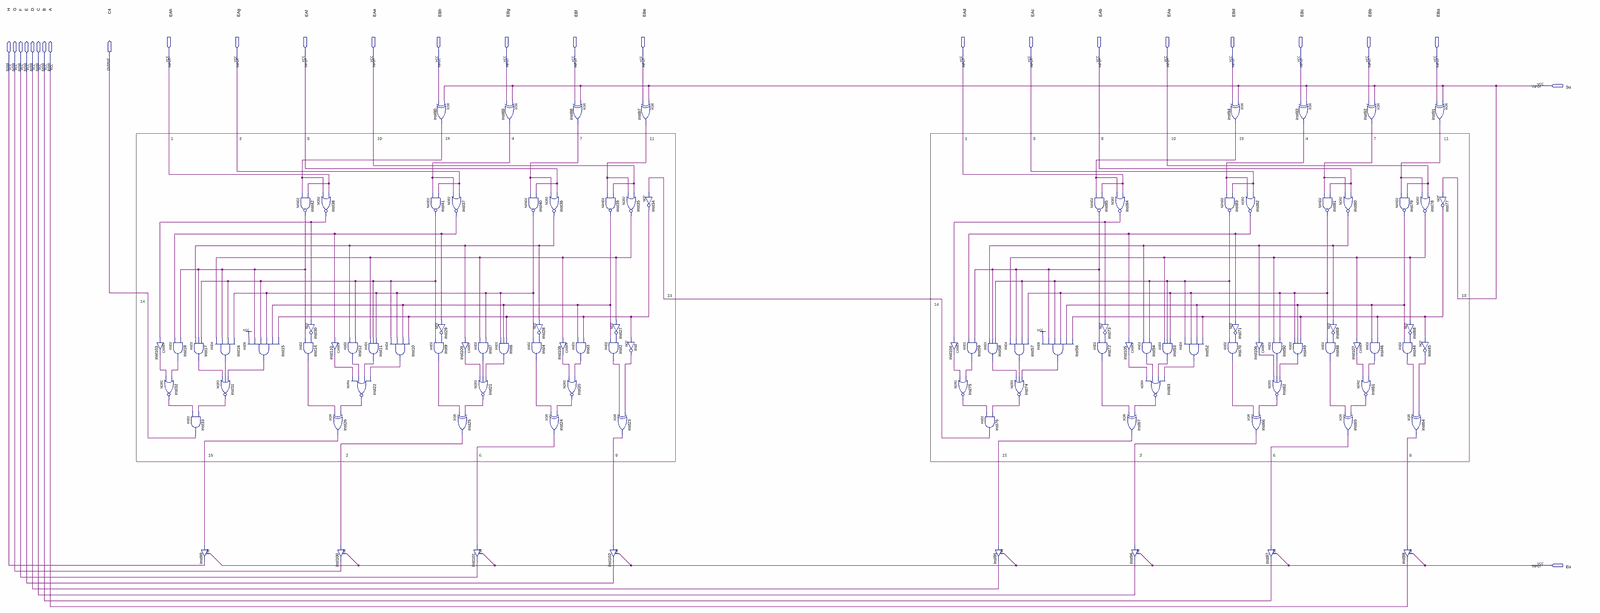
[diagram p0: schematic sheet, whole]
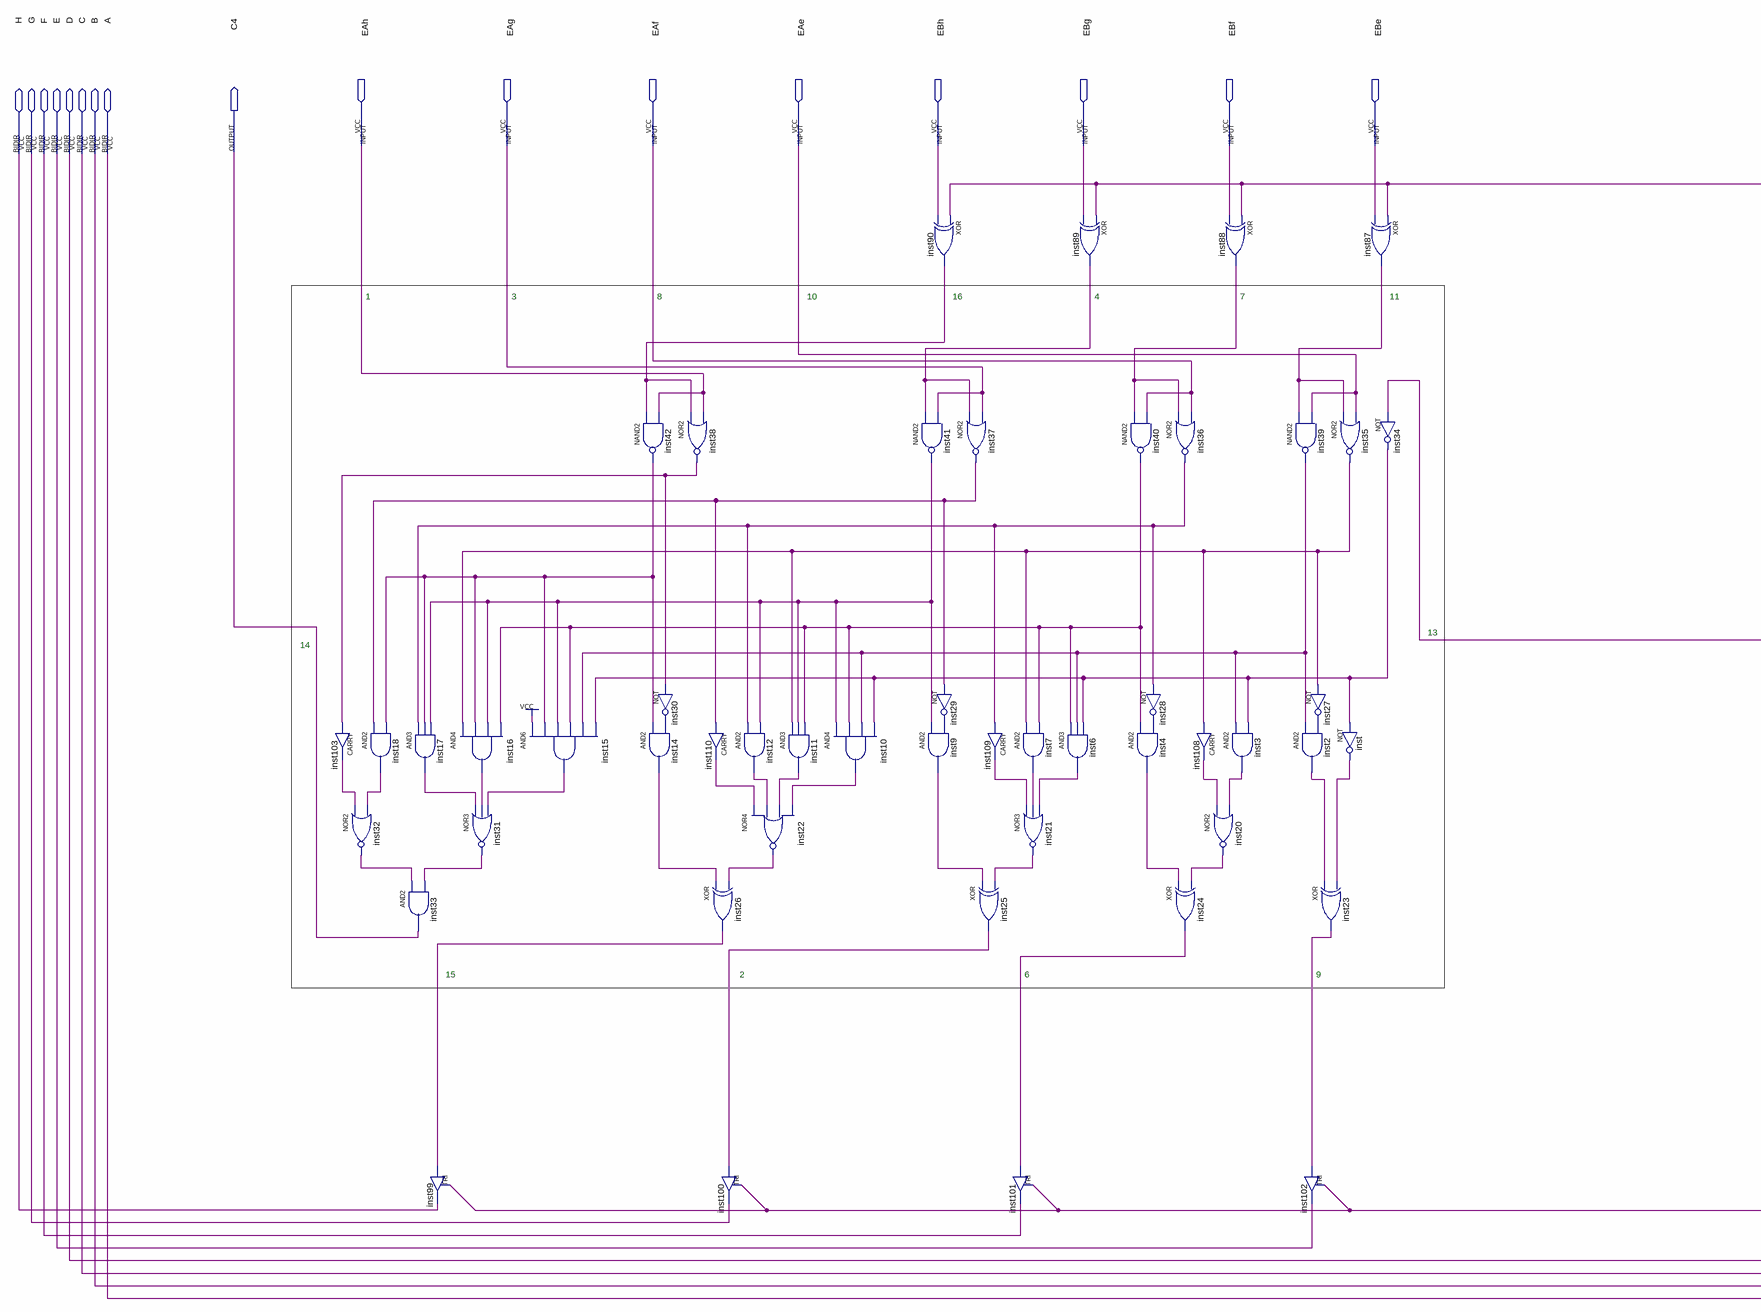
[diagram p1: schematic sheet, left part]
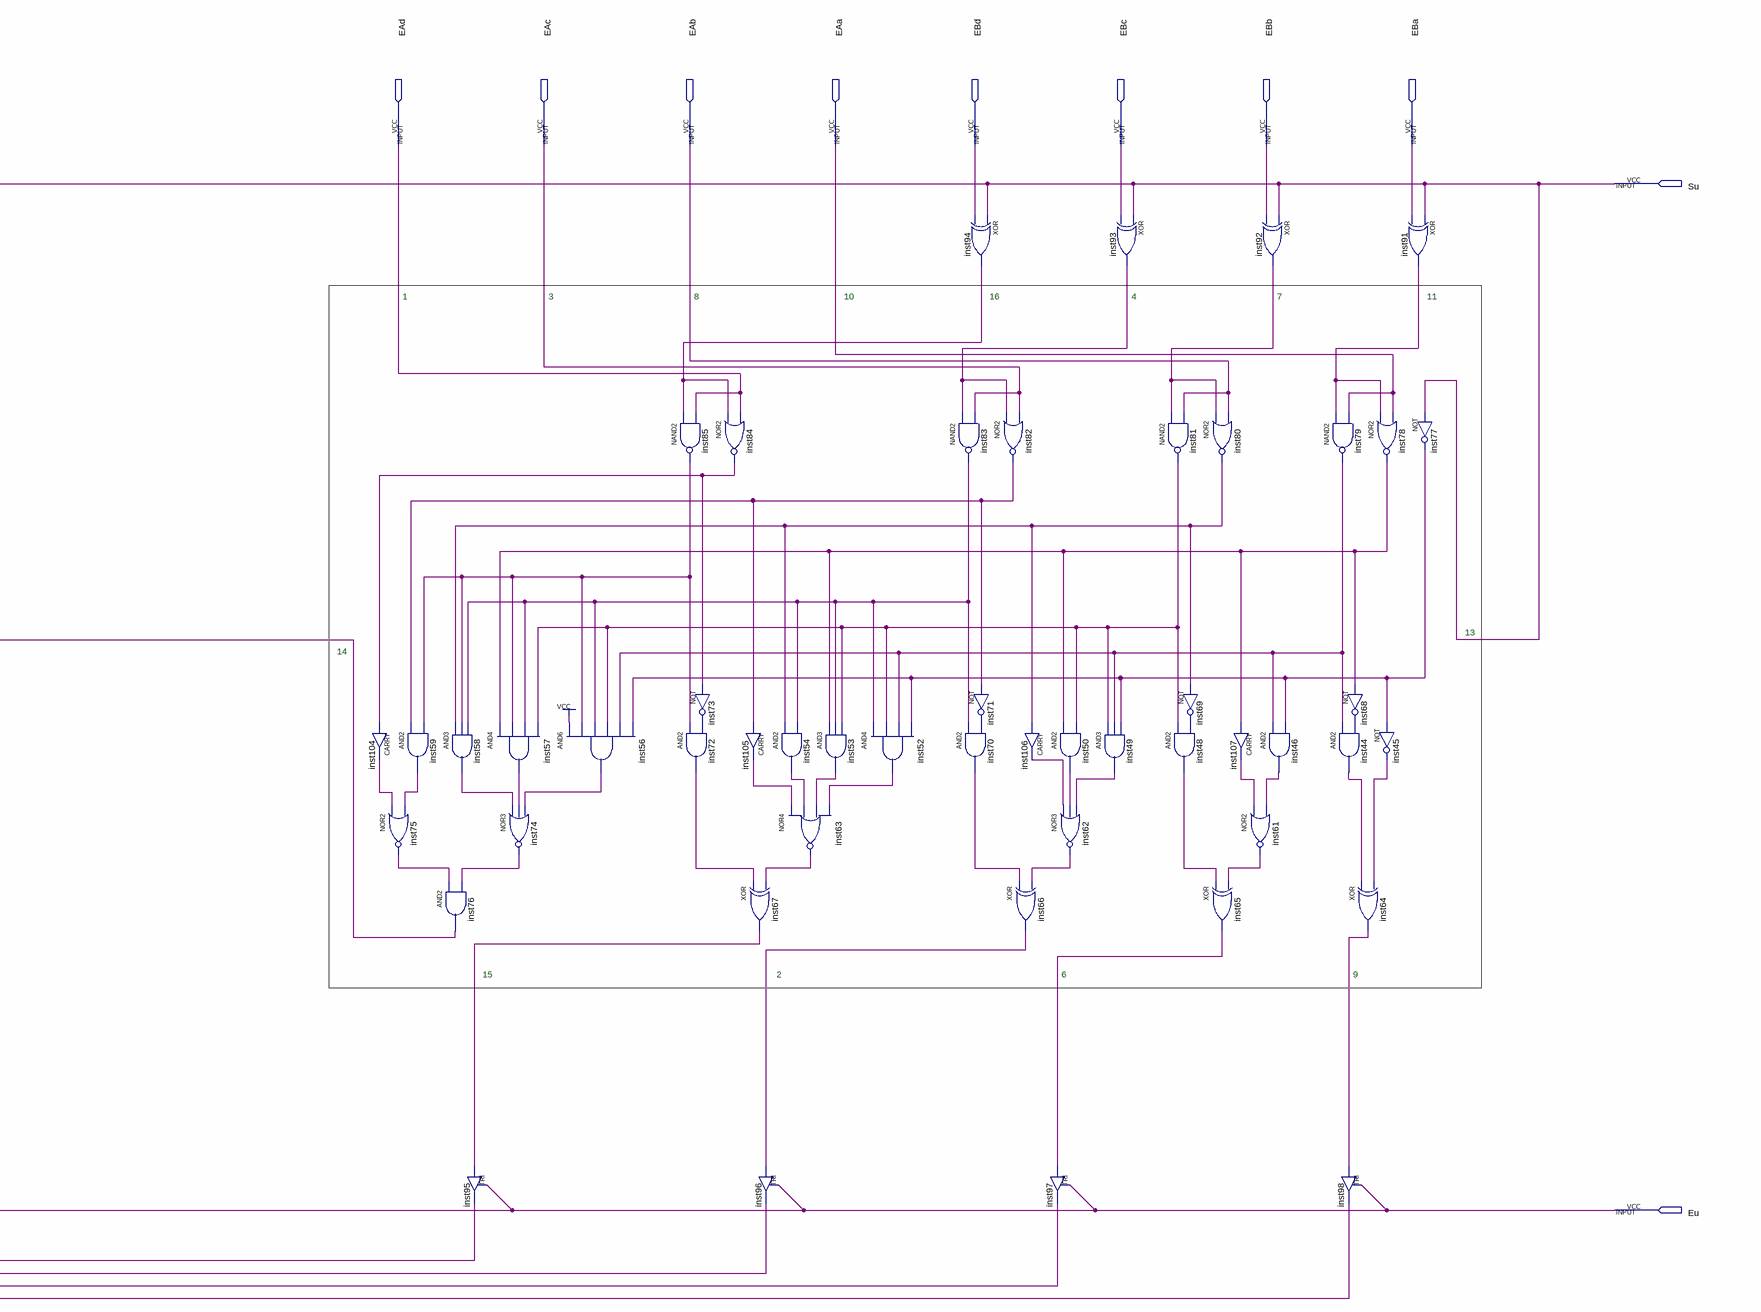
[diagram p2: schematic sheet, right part]
// Quartus schematic adder_and_subtractor.bdf as structural Verilog: 100 symbols, 27 pins
module adder_and_subtractor (
  input  EAh,
  input  EAg,
  input  EAf,
  input  EAe,
  input  EBh,
  input  EBg,
  input  EBf,
  input  EBe,
  input  EAd,
  input  EAc,
  input  EAb,
  input  EAa,
  input  EBd,
  input  EBc,
  input  EBb,
  input  EBa,
  input  Su,
  input  Eu,
  inout  H,
  inout  G,
  inout  F,
  inout  E,
  inout  D,
  inout  C,
  inout  B,
  inout  A,
  output C4
);

  wire inst2_out, inst3_out, inst4_out, inst6_out, inst7_out, inst9_out, inst10_out, inst11_out, inst12_out,
       inst14_out, inst15_out, inst16_out, inst17_out, inst18_out, inst20_out, inst21_out, inst22_out,
       inst23_out, inst24_out, inst25_out, inst26_out, inst27_out, inst28_out, inst29_out, inst30_out,
       inst31_out, inst32_out, inst34_out, inst35_out, inst36_out, inst37_out, inst38_out, inst39_out,
       inst40_out, inst41_out, inst42_out, inst44_out, inst45_out, inst46_out, inst48_out, inst49_out,
       inst50_out, inst52_out, inst53_out, inst54_out, inst56_out, inst57_out, inst58_out, inst59_out,
       inst61_out, inst62_out, inst63_out, inst64_out, inst65_out, inst66_out, inst67_out, inst68_out,
       inst69_out, inst70_out, inst71_out, inst72_out, inst73_out, inst74_out, inst75_out, inst76_out,
       inst77_out, inst78_out, inst79_out, inst80_out, inst81_out, inst82_out, inst83_out, inst84_out,
       inst85_out, inst87_out, inst88_out, inst89_out, inst90_out, inst91_out, inst92_out, inst93_out,
       inst94_out, inst103_out, inst104_out, inst105_out, inst106_out, inst107_out, inst108_out, inst109_out,
       inst110_out, inst_out;

  and inst18 (inst18_out, inst37_out, inst42_out);
  CARRY inst103 (.IN(inst38_out), .OUT(inst103_out));
  nor inst32 (inst32_out, inst103_out, inst18_out);
  and inst17 (inst17_out, inst36_out, inst42_out, inst41_out);
  and inst33 (C4, inst32_out, inst31_out);
  and inst16 (inst16_out, inst35_out, inst42_out, inst41_out, inst40_out);
  nor inst31 (inst31_out, inst17_out, inst16_out, inst15_out);
  TRI inst99 (.IN(inst26_out), .OE(Eu), .OUT(H));
  and inst15 (inst15_out, 1'b1, inst42_out, inst41_out, inst40_out, inst39_out, inst34_out);
  nand inst42 (inst42_out, inst90_out, EAh);
  not inst30 (inst30_out, inst38_out);
  and inst14 (inst14_out, inst42_out, inst30_out);
  nor inst38 (inst38_out, inst90_out, EAh);
  CARRY inst110 (.IN(inst37_out), .OUT(inst110_out));
  xor inst26 (inst26_out, inst14_out, inst22_out);
  TRI inst100 (.IN(inst25_out), .OE(Eu), .OUT(G));
  and inst12 (inst12_out, inst36_out, inst41_out);
  nor inst22 (inst22_out, inst110_out, inst12_out, inst11_out, inst10_out);
  and inst10 (inst10_out, inst41_out, inst40_out, inst39_out, inst34_out);
  and inst11 (inst11_out, inst35_out, inst41_out, inst40_out);
  xor inst90 (inst90_out, Su, EBh);
  nand inst41 (inst41_out, inst89_out, EAg);
  and inst9 (inst9_out, inst41_out, inst29_out);
  nor inst37 (inst37_out, inst89_out, EAg);
  not inst29 (inst29_out, inst37_out);
  xor inst25 (inst25_out, inst9_out, inst21_out);
  and inst7 (inst7_out, inst35_out, inst40_out);
  CARRY inst109 (.IN(inst36_out), .OUT(inst109_out));
  nor inst21 (inst21_out, inst109_out, inst7_out, inst6_out);
  TRI inst101 (.IN(inst24_out), .OE(Eu), .OUT(F));
  xor inst89 (inst89_out, Su, EBg);
  and inst6 (inst6_out, inst40_out, inst39_out, inst34_out);
  nand inst40 (inst40_out, inst88_out, EAf);
  and inst4 (inst4_out, inst40_out, inst28_out);
  nor inst36 (inst36_out, inst88_out, EAf);
  not inst28 (inst28_out, inst36_out);
  xor inst24 (inst24_out, inst4_out, inst20_out);
  xor inst88 (inst88_out, Su, EBf);
  and inst3 (inst3_out, inst39_out, inst34_out);
  CARRY inst108 (.IN(inst35_out), .OUT(inst108_out));
  nor inst20 (inst20_out, inst108_out, inst3_out);
  nor inst35 (inst35_out, inst87_out, EAe);
  nand inst39 (inst39_out, inst87_out, EAe);
  not inst27 (inst27_out, inst35_out);
  and inst2 (inst2_out, inst39_out, inst27_out);
  xor inst23 (inst23_out, inst2_out, inst_out);
  TRI inst102 (.IN(inst23_out), .OE(Eu), .OUT(E));
  xor inst87 (inst87_out, Su, EBe);
  not inst34 (inst34_out, inst76_out);
  not inst (inst_out, inst34_out);
  CARRY inst104 (.IN(inst84_out), .OUT(inst104_out));
  nor inst75 (inst75_out, inst104_out, inst59_out);
  and inst59 (inst59_out, inst82_out, inst85_out);
  and inst58 (inst58_out, inst80_out, inst85_out, inst83_out);
  and inst76 (inst76_out, inst75_out, inst74_out);
  TRI inst95 (.IN(inst67_out), .OE(Eu), .OUT(D));
  and inst57 (inst57_out, inst78_out, inst85_out, inst83_out, inst81_out);
  nor inst74 (inst74_out, inst58_out, inst57_out, inst56_out);
  and inst56 (inst56_out, 1'b1, inst85_out, inst83_out, inst81_out, inst79_out, inst77_out);
  nand inst85 (inst85_out, inst94_out, EAd);
  and inst72 (inst72_out, inst85_out, inst73_out);
  nor inst84 (inst84_out, inst94_out, EAd);
  not inst73 (inst73_out, inst84_out);
  and inst54 (inst54_out, inst80_out, inst83_out);
  CARRY inst105 (.IN(inst82_out), .OUT(inst105_out));
  nor inst63 (inst63_out, inst105_out, inst54_out, inst53_out, inst52_out);
  xor inst67 (inst67_out, inst72_out, inst63_out);
  TRI inst96 (.IN(inst66_out), .OE(Eu), .OUT(C));
  and inst53 (inst53_out, inst78_out, inst83_out, inst81_out);
  and inst52 (inst52_out, inst83_out, inst81_out, inst79_out, inst77_out);
  xor inst94 (inst94_out, Su, EBd);
  nand inst83 (inst83_out, inst93_out, EAc);
  not inst71 (inst71_out, inst82_out);
  and inst70 (inst70_out, inst83_out, inst71_out);
  nor inst82 (inst82_out, inst93_out, EAc);
  CARRY inst106 (.IN(inst80_out), .OUT(inst106_out));
  xor inst66 (inst66_out, inst70_out, inst62_out);
  and inst50 (inst50_out, inst78_out, inst81_out);
  nor inst62 (inst62_out, inst106_out, inst50_out, inst49_out);
  TRI inst97 (.IN(inst65_out), .OE(Eu), .OUT(B));
  xor inst93 (inst93_out, Su, EBc);
  and inst49 (inst49_out, inst81_out, inst79_out, inst77_out);
  nand inst81 (inst81_out, inst92_out, EAb);
  not inst69 (inst69_out, inst80_out);
  and inst48 (inst48_out, inst81_out, inst69_out);
  nor inst80 (inst80_out, inst92_out, EAb);
  CARRY inst107 (.IN(inst78_out), .OUT(inst107_out));
  nor inst61 (inst61_out, inst107_out, inst46_out);
  xor inst65 (inst65_out, inst48_out, inst61_out);
  xor inst92 (inst92_out, Su, EBb);
  and inst46 (inst46_out, inst79_out, inst77_out);
  nand inst79 (inst79_out, inst91_out, EAa);
  not inst68 (inst68_out, inst78_out);
  and inst44 (inst44_out, inst79_out, inst68_out);
  TRI inst98 (.IN(inst64_out), .OE(Eu), .OUT(A));
  nor inst78 (inst78_out, inst91_out, EAa);
  not inst45 (inst45_out, inst77_out);
  xor inst64 (inst64_out, inst44_out, inst45_out);
  xor inst91 (inst91_out, Su, EBa);
  not inst77 (inst77_out, Su);

  // Notes on the sheet:
  //   1
  //   3
  //   8
  //   10
  //   16
  //   4
  //   7
  //   11
  //   1
  //   3
  //   8
  //   10
  //   16
  //   4
  //   7
  //   11
  //   13
  //   13
  //   14
  //   14
  //   15
  //   2
  //   6
  //   9
  //   15
  //   2
  //   6
  //   9
endmodule
